# EAGLE board LED_sculpture (EAGLE 9.4.2)
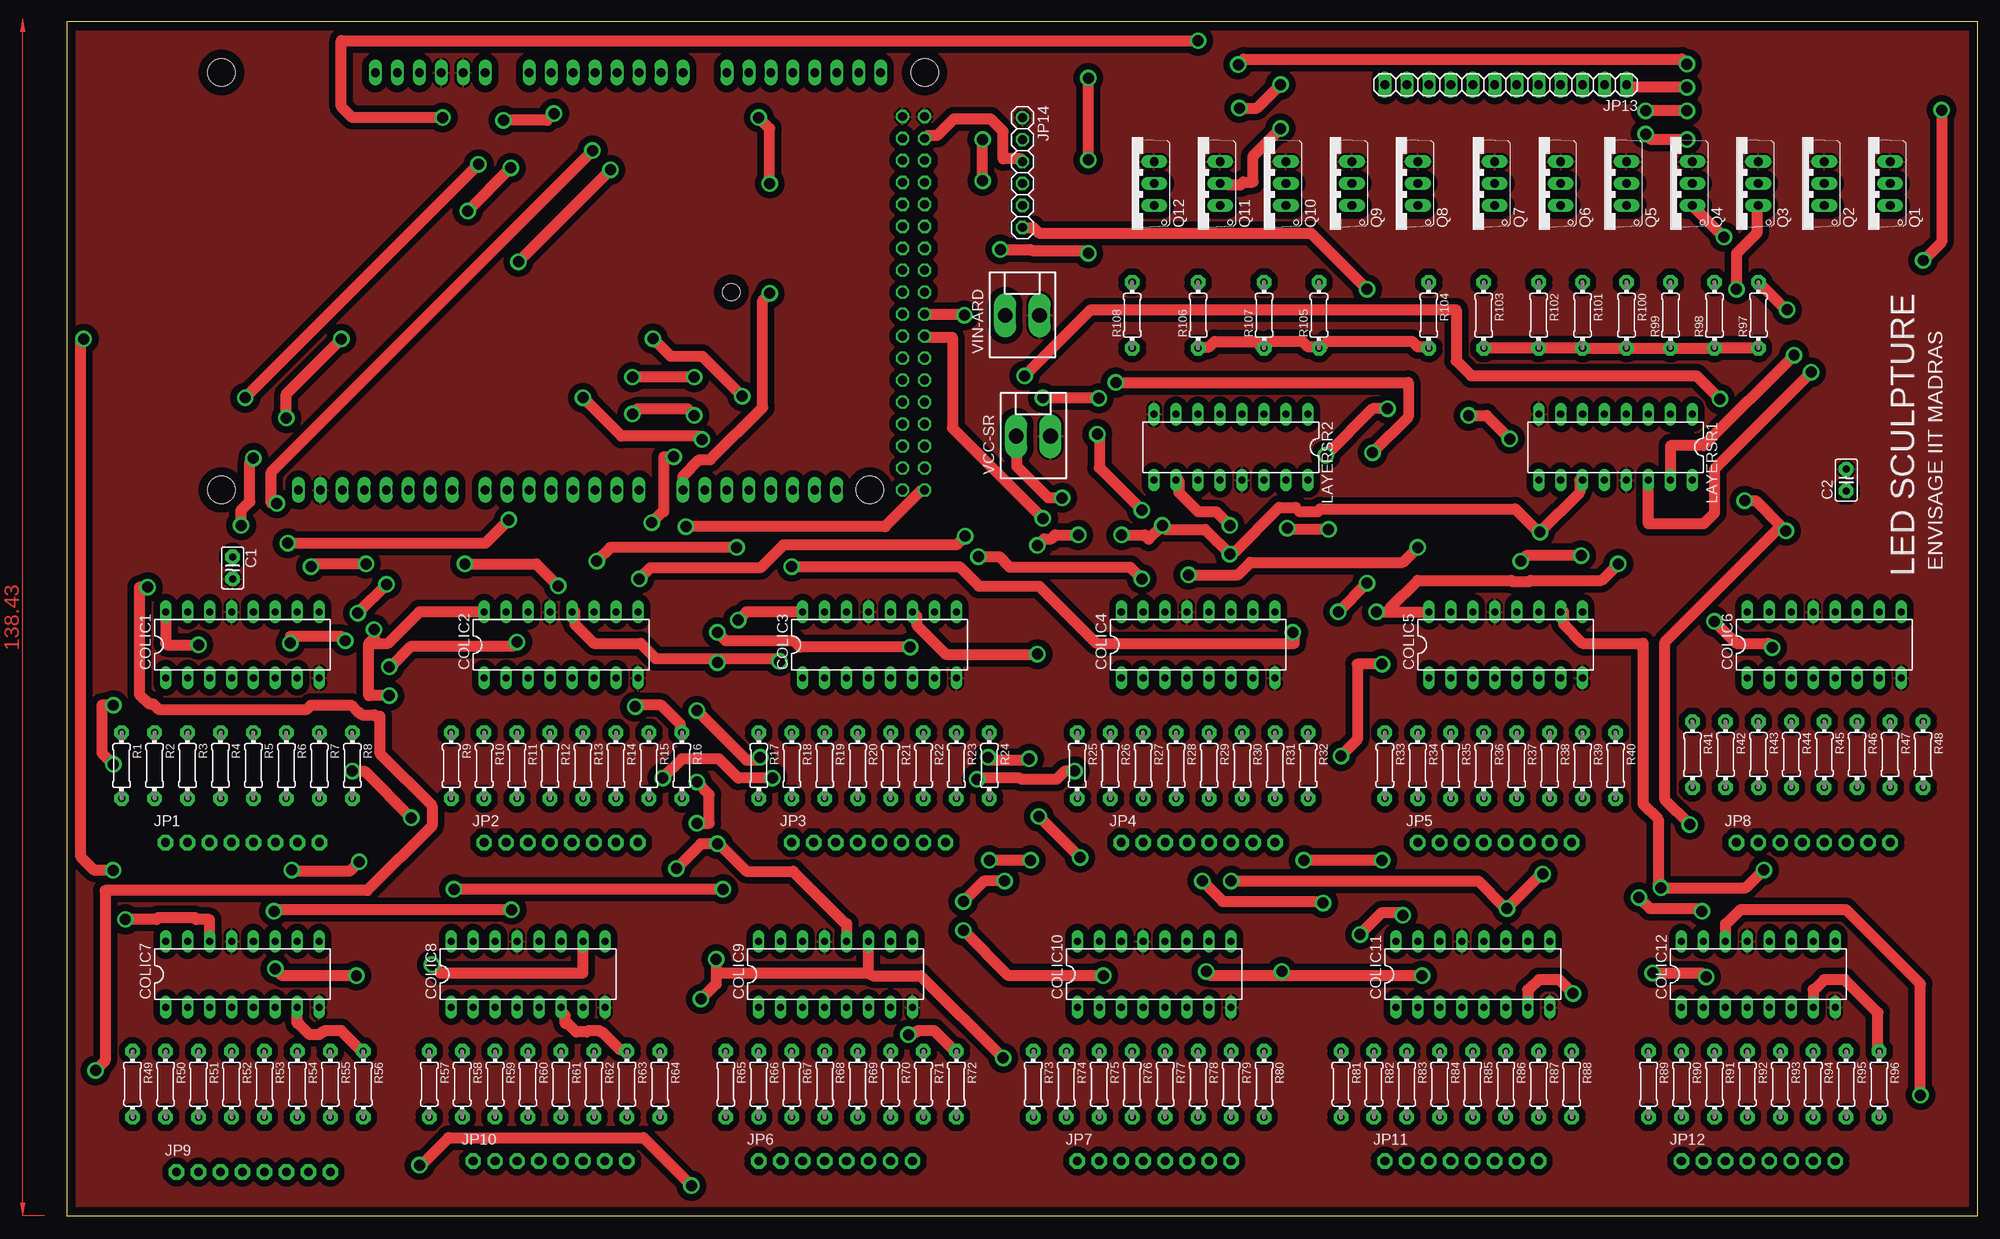
[diagram p3: board, top side]
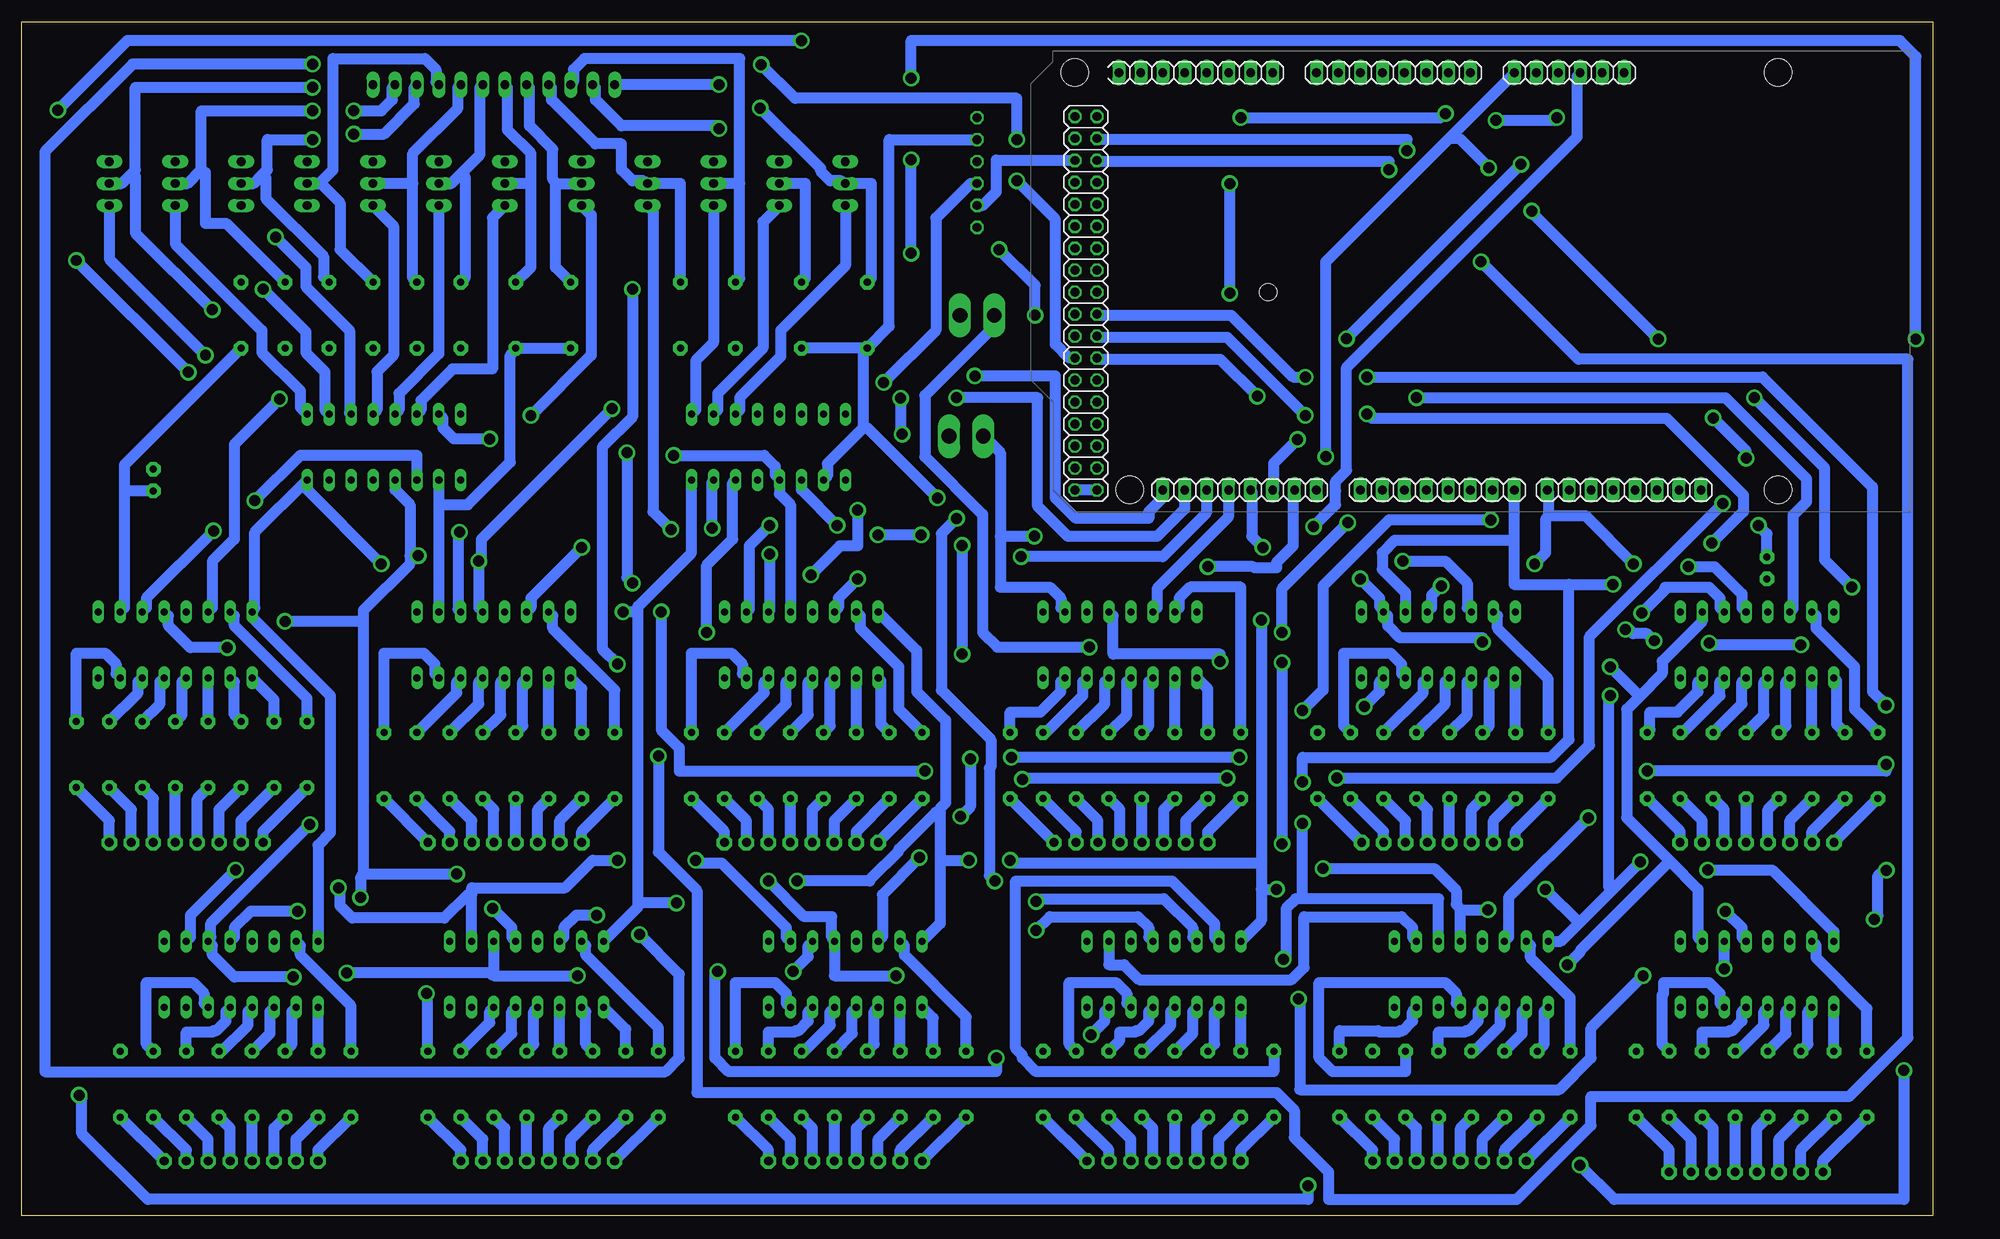
[diagram p4: board, bottom side, seen from below]

Size 220.96 x 138.1 mm. Coordinates in mm from the lower left corner, seen from the top.
Outline: 0,0 220.96,0 220.96,138.1 0,138.1 0,0
Copper layers (1*16): Top 0.035mm / dielectric 1.5mm / Bottom 0.035mm
Design rules "default": minimum track width 6mil, minimum drill 0.35mm, track to track 6mil, track to pad 6mil, pad to pad 6mil, via to via 6mil, smd to smd 6mil, copper to edge 40mil, drill to drill 6mil, minimum pad ring 10mil, minimum via ring 8mil, stop-mask expansion 4mil, vias tented up to drill 0mil, thermal gap 10mil
Net classes: 0 default: width 1.27 mm, drill 1.27 mm, clearance 0.762 mm

## Footprints (pad centres in the part's own frame; a part is rotated, then mirrored left to right if it is on the bottom)
C025-025X050 = drill 0.813 pad 1.676 octagon: 1 -1.27,0; 2 1.27,0
DIL16 = drill 0.813 long: 1 -8.89,-3.81; 2 -6.35,-3.81; 3 -3.81,-3.81; 4 -1.27,-3.81; 5 1.27,-3.81; 6 3.81,-3.81; 7 6.35,-3.81; 8 8.89,-3.81; 9 8.89,3.81; 10 6.35,3.81; 11 3.81,3.81; 12 1.27,3.81; 13 -1.27,3.81; 14 -3.81,3.81; 15 -6.35,3.81; 16 -8.89,3.81
MEGA_ARDUINO = drill 1.016 long: 1 33.02,2.54; 2 35.56,2.54; 3 38.1,2.54; 4 40.64,2.54; 5 43.18,2.54; 6 45.72,2.54; 7 50.8,2.54; 8 53.34,2.54; 9 55.88,2.54; 10 58.42,2.54; 11 60.96,2.54; 12 63.5,2.54; 13 66.04,2.54; 14 68.58,2.54; 15 73.66,2.54; 16 76.2,2.54; 17 78.74,2.54; 18 81.28,2.54; 19 83.82,2.54; 20 86.36,2.54; 21 88.9,2.54; 22 91.44,2.54; 23 86.36,50.8; 24 83.82,50.8; 25 81.28,50.8; 26 78.74,50.8; 27 76.2,50.8; 28 73.66,50.8; 29 71.12,50.8; 30 68.58,50.8; 31 63.5,50.8; 32 60.96,50.8; 33 58.42,50.8; 34 55.88,50.8; 35 53.34,50.8; 36 50.8,50.8; 37 48.26,50.8; 38 45.72,50.8; 39 41.91,50.8; 40 39.37,50.8; 41 36.83,50.8; 42 34.29,50.8; 43 31.75,50.8; 44 29.21,50.8; 45 26.67,50.8; 46 24.13,50.8 | drill 1.016 octagon: 47 93.98,50.8; 48 96.52,50.8; 49 93.98,48.26; 50 96.52,48.26; 51 93.98,45.72; 52 96.52,45.72; 53 93.98,43.18; 54 96.52,43.18; 55 93.98,40.64; 56 96.52,40.64; 57 93.98,38.1; 58 96.52,38.1; 59 93.98,35.56; 60 96.52,35.56; 61 93.98,33.02; 62 96.52,33.02; 63 93.98,30.48; 64 96.52,30.48; 65 93.98,27.94; 66 96.52,27.94; 67 93.98,25.4; 68 96.52,25.4; 69 93.98,22.86; 70 96.52,22.86; 71 93.98,20.32; 72 96.52,20.32; 73 93.98,17.78; 74 96.52,17.78; 75 93.98,15.24; 76 96.52,15.24; 77 93.98,12.7; 78 96.52,12.7; 79 93.98,10.16; 80 96.52,10.16; 81 93.98,7.62; 82 96.52,7.62 | hole 3.2: 15.24,50.8; 15.24,2.54; 90.17,50.8; 96.52,2.54 | hole 2: 74.168,27.94
1X08-CLEANBIG = drill 1.016 pad 1.778 octagon: 1 -8.89,0; 2 -6.35,0; 3 -3.81,0; 4 -1.27,0; 5 1.27,0; 6 3.81,0; 7 6.35,0; 8 8.89,0
1X12 = drill 1.016 long: 1 -13.97,0; 2 -11.43,0; 3 -8.89,0; 4 -6.35,0; 5 -3.81,0; 6 -1.27,0; 7 1.27,0; 8 3.81,0; 9 6.35,0; 10 8.89,0; 11 11.43,0; 12 13.97,0
1X06 = drill 1.016 octagon: 1 -6.35,0; 2 -3.81,0; 3 -1.27,0; 4 1.27,0; 5 3.81,0; 6 6.35,0
TO220V = drill 1.016 long: 1 -2.54,-2.54; 2 0,-2.54; 3 2.54,-2.54
0204/7 = drill 0.813 pad 1.676 octagon: 1 -3.81,0; 2 3.81,0
KK-156-2 = drill 1.7 pad 2.184 long: 1 -1.98,0; 2 1.98,0

## Placement (x,y rotation side)
C1  [C025-025X050]  19.18,74.93 270 top
C2  [C025-025X050]  205.74,85.09 90 top
COLIC1  74HC595N  [DIL16]  20.32,66.04 0 top
COLIC2  74HC595N  [DIL16]  57.15,66.04 0 top
COLIC3  74HC595N  [DIL16]  93.98,66.04 0 top
COLIC4  74HC595N  [DIL16]  130.81,66.04 0 top
COLIC5  74HC595N  [DIL16]  166.37,66.04 0 top
COLIC6  74HC595N  [DIL16]  203.2,66.04 0 top
COLIC7  74HC595N  [DIL16]  20.32,27.94 0 top
COLIC8  74HC595N  [DIL16]  53.34,27.94 0 top
COLIC9  74HC595N  [DIL16]  88.9,27.94 0 top
COLIC10  74HC595N  [DIL16]  125.73,27.94 0 top
COLIC11  74HC595N  [DIL16]  162.56,27.94 0 top
COLIC12  74HC595N  [DIL16]  195.58,27.94 0 top
IC1  [MEGA_ARDUINO]  2.67,134.75 180 bottom
JP1  [1X08-CLEANBIG]  20.32,43.18 0 top
JP2  [1X08-CLEANBIG]  57.15,43.18 0 top
JP3  [1X08-CLEANBIG]  92.71,43.18 0 top
JP4  [1X08-CLEANBIG]  130.81,43.18 0 top
JP5  [1X08-CLEANBIG]  165.1,43.18 0 top
JP6  [1X08-CLEANBIG]  88.9,6.35 0 top
JP7  [1X08-CLEANBIG]  125.73,6.35 0 top
JP8  [1X08-CLEANBIG]  201.93,43.18 0 top
JP9  [1X08-CLEANBIG]  21.59,5.08 0 top
JP10  [1X08-CLEANBIG]  55.88,6.35 0 top
JP11  [1X08-CLEANBIG]  161.29,6.35 0 top
JP12  [1X08-CLEANBIG]  195.58,6.35 0 top
JP13  [1X12]  166.37,130.81 180 top
JP14  [1X06]  110.49,120.65 270 top
LAYERSR1  74HC595N  [DIL16]  179.07,88.9 180 top
LAYERSR2  74HC595N  [DIL16]  134.62,88.9 180 top
Q1  [TO220V]  208.28,119.38 90 top
Q2  [TO220V]  200.66,119.38 90 top
Q3  [TO220V]  193.04,119.38 90 top
Q4  [TO220V]  185.42,119.38 90 top
Q5  [TO220V]  177.8,119.38 90 top
Q6  [TO220V]  170.18,119.38 90 top
Q7  [TO220V]  162.56,119.38 90 top
Q8  [TO220V]  153.67,119.38 90 top
Q9  [TO220V]  146.05,119.38 90 top
Q10  [TO220V]  138.43,119.38 90 top
Q11  [TO220V]  130.81,119.38 90 top
Q12  [TO220V]  123.19,119.38 90 top
R1  [0204/7]  6.35,52.07 270 top
R2  [0204/7]  10.16,52.07 270 top
R3  [0204/7]  13.97,52.07 270 top
R4  [0204/7]  17.78,52.07 270 top
R5  [0204/7]  21.59,52.07 270 top
R6  [0204/7]  25.4,52.07 270 top
R7  [0204/7]  29.21,52.07 270 top
R8  [0204/7]  33.02,52.07 270 top
R9  [0204/7]  44.45,52.07 270 top
R10  [0204/7]  48.26,52.07 270 top
R11  [0204/7]  52.07,52.07 270 top
R12  [0204/7]  55.88,52.07 270 top
R13  [0204/7]  59.69,52.07 270 top
R14  [0204/7]  63.5,52.07 270 top
R15  [0204/7]  67.31,52.07 270 top
R16  [0204/7]  71.12,52.07 270 top
R17  [0204/7]  80.01,52.07 270 top
R18  [0204/7]  83.82,52.07 270 top
R19  [0204/7]  87.63,52.07 270 top
R20  [0204/7]  91.44,52.07 270 top
R21  [0204/7]  95.25,52.07 270 top
R22  [0204/7]  99.06,52.07 270 top
R23  [0204/7]  102.87,52.07 270 top
R24  [0204/7]  106.68,52.07 270 top
R25  [0204/7]  116.84,52.07 270 top
R26  [0204/7]  120.65,52.07 270 top
R27  [0204/7]  124.46,52.07 270 top
R28  [0204/7]  128.27,52.07 270 top
R29  [0204/7]  132.08,52.07 270 top
R30  [0204/7]  135.89,52.07 270 top
R31  [0204/7]  139.7,52.07 270 top
R32  [0204/7]  143.51,52.07 270 top
R33  [0204/7]  152.4,52.07 270 top
R34  [0204/7]  156.21,52.07 270 top
R35  [0204/7]  160.02,52.07 270 top
R36  [0204/7]  163.83,52.07 270 top
R37  [0204/7]  167.64,52.07 270 top
R38  [0204/7]  171.45,52.07 270 top
R39  [0204/7]  175.26,52.07 270 top
R40  [0204/7]  179.07,52.07 270 top
R41  [0204/7]  187.96,53.34 270 top
R42  [0204/7]  191.77,53.34 270 top
R43  [0204/7]  195.58,53.34 270 top
R44  [0204/7]  199.39,53.34 270 top
R45  [0204/7]  203.2,53.34 270 top
R46  [0204/7]  207.01,53.34 270 top
R47  [0204/7]  210.82,53.34 270 top
R48  [0204/7]  214.63,53.34 270 top
R49  [0204/7]  7.62,15.24 270 top
R50  [0204/7]  11.43,15.24 270 top
R51  [0204/7]  15.24,15.24 270 top
R52  [0204/7]  19.05,15.24 270 top
R53  [0204/7]  22.86,15.24 270 top
R54  [0204/7]  26.67,15.24 270 top
R55  [0204/7]  30.48,15.24 270 top
R56  [0204/7]  34.29,15.24 270 top
R57  [0204/7]  41.91,15.24 270 top
R58  [0204/7]  45.72,15.24 270 top
R59  [0204/7]  49.53,15.24 270 top
R60  [0204/7]  53.34,15.24 270 top
R61  [0204/7]  57.15,15.24 270 top
R62  [0204/7]  60.96,15.24 270 top
R63  [0204/7]  64.77,15.24 270 top
R64  [0204/7]  68.58,15.24 270 top
R65  [0204/7]  76.2,15.24 270 top
R66  [0204/7]  80.01,15.24 270 top
R67  [0204/7]  83.82,15.24 270 top
R68  [0204/7]  87.63,15.24 270 top
R69  [0204/7]  91.44,15.24 270 top
R70  [0204/7]  95.25,15.24 270 top
R71  [0204/7]  99.06,15.24 270 top
R72  [0204/7]  102.87,15.24 270 top
R73  [0204/7]  111.76,15.24 270 top
R74  [0204/7]  115.57,15.24 270 top
R75  [0204/7]  119.38,15.24 270 top
R76  [0204/7]  123.19,15.24 270 top
R77  [0204/7]  127,15.24 270 top
R78  [0204/7]  130.81,15.24 270 top
R79  [0204/7]  134.62,15.24 270 top
R80  [0204/7]  138.43,15.24 270 top
R81  [0204/7]  147.32,15.24 270 top
R82  [0204/7]  151.13,15.24 270 top
R83  [0204/7]  154.94,15.24 270 top
R84  [0204/7]  158.75,15.24 270 top
R85  [0204/7]  162.56,15.24 270 top
R86  [0204/7]  166.37,15.24 270 top
R87  [0204/7]  170.18,15.24 270 top
R88  [0204/7]  173.99,15.24 270 top
R89  [0204/7]  182.88,15.24 270 top
R90  [0204/7]  186.69,15.24 270 top
R91  [0204/7]  190.5,15.24 270 top
R92  [0204/7]  194.31,15.24 270 top
R93  [0204/7]  198.12,15.24 270 top
R94  [0204/7]  201.93,15.24 270 top
R95  [0204/7]  205.74,15.24 270 top
R96  [0204/7]  209.55,15.24 270 top
R97  [0204/7]  195.58,104.14 90 top
R98  [0204/7]  190.5,104.14 90 top
R99  [0204/7]  185.42,104.14 90 top
R100  [0204/7]  180.34,104.14 90 top
R101  [0204/7]  175.26,104.14 270 top
R102  [0204/7]  170.18,104.14 270 top
R103  [0204/7]  163.83,104.14 270 top
R104  [0204/7]  157.48,104.14 270 top
R105  [0204/7]  144.78,104.14 90 top
R106  [0204/7]  130.81,104.14 90 top
R107  [0204/7]  138.43,104.14 90 top
R108  [0204/7]  123.19,104.14 90 top
VCC-SR  [KK-156-2]  111.76,90.17 0 top
VIN-ARD  [KK-156-2]  110.49,104.14 0 top

## Tracks (layer width: path | path; a pad name or v marks a point on that pad's centre or on a via)
5V  (via drill 1.27)
  Top 1.27: v52.07,66.36 51.59,65.88 39.85,65.88 37.47,63.5 v37.31,63.5 | COLIC8.10 59.69,28.1 43.18,28.1 v42.23,29.05 | v134.46,79.85 132.87,81.44 130.81,81.44 128.59,83.66 128.59,85.09 LAYERSR2.10 | R106.1 130.97,100.33 131.13,100.49 132.08,100.49 132.72,101.12 137.48,101.12 137.95,100.65 R107.1 139.22,101.12 142.88,101.12 143.51,100.49 144.46,100.49 144.62,100.33 R105.1 145.26,100.65 145.73,101.12 155.58,101.12 156.21,100.49 157.16,100.49 157.32,100.33 R104.2 | v115.09,83.03 113.51,83.03 109.85,86.68 109.85,90.17 VCC-SR.1 | v152.08,41.12 v143.03,41.12 | v196.22,40 194.15,37.94 v184.31,37.94 183.99,38.42 183.99,45.88 182.25,47.62 182.25,66.2 175.26,66.2 173.04,68.42 173.04,69.85 COLIC5.10 | R97.1 R98.1 R99.1 R100.1 R101.2 R102.2 R103.2 | v66.2,73.66 67.47,74.93 80.2,74.93 82.87,77.6 102.87,77.6 v103.89,78.61
  Bottom 1.27: COLIC8.10 60.17,32.23 60.17,33.34 61.44,34.61 72.71,34.61 72.71,28.73 74.14,27.3 91.76,27.3 93.5,29.05 95.25,29.05 COLIC9.10 | COLIC7.10 27.15,32.23 27.15,37.78 30.4,41.04 | 30.4,41.04 35.4,46.04 35.4,58.58 33.89,60.09 | 33.89,60.09 31.27,62.71 31.27,64.13 26.67,68.74 COLIC1.10 | v52.07,66.36 52.07,66.83 61.6,66.83 63.02,68.26 63.02,69.37 COLIC2.10 63.82,70.33 63.98,70.48 63.98,71.44 v66.2,73.66 | 33.89,60.09 v37.31,63.5 | v42.23,29.05 40.8,30.48 40.8,30.64 30.4,41.04 | COLIC3.10 100.81,70.33 100.81,71.44 102.08,72.71 107.79,72.71 107.79,78.61 | 107.79,78.61 107.79,88.27 109.7,90.17 VCC-SR.1 | COLIC4.10 136.84,70.17 136.84,77.47 v134.46,79.85 | JP14.2 120.65,124.46 120.65,102.87 R108.1 | R108.1 R106.1 | LAYERSR2.10 127.79,85.57 127.79,87 123.67,91.12 | 123.67,91.12 123.67,99.85 R108.1 | v115.09,83.03 123.19,91.12 123.67,91.12 | COLIC10.10 132.56,32.23 132.56,33.34 140.02,40.8 143.03,40.8 v143.03,41.12 | v152.08,41.12 154.94,41.12 158.12,37.94 168.91,37.94 168.91,37.15 | COLIC11.10 168.91,37.15 | COLIC12.10 201.45,32.23 201.45,34.77 v196.22,40 | v184.31,37.94 184.15,37.78 184.15,35.88 182.72,34.45 172.09,34.45 169.39,37.15 168.91,37.15 | R104.2 R103.2 164.15,99.85 164.47,99.54 164.47,87.15 169.39,82.23 172.72,82.23 | LAYERSR1.10 172.72,82.23 | 172.72,82.23 COLIC5.10 | COLIC6.10 209.07,70.33 209.07,83.82 | 209.07,83.82 209.07,86.84 R97.1 | 107.79,78.61 v103.89,78.61 | C2.1 209.07,83.82
+5V  (via drill 1.27)
  Top 1.27: v71.6,79.69 94.61,79.69 98.74,83.82 99.06,83.82 IC1.48
  Bottom 1.27: IC1.47 96.68,83.98 99.06,83.98 IC1.48 | v71.6,79.69 69.06,82.23 69.06,83.82 69.06,84.93 67.79,86.2 67.79,98.11 41.12,124.78 41.12,131.76 40.8,132.08 IC1.3
GND
  pour Top: 0,138.43 0,0 220.98,0 220.98,138.43
N$1  (via drill 1.27)
  Top 1.27: v166.85,89.85 164.15,92.55 v162.08,92.55
  Bottom 1.27: LAYERSR1.7 172.24,92.23 172.24,91.12 170.97,89.85 v166.85,89.85 | v162.08,92.55 155.1,99.54 155.1,115.73 Q8.1
N$2
  Bottom 1.27: LAYERSR1.6 174.78,93.19 174.78,94.3 171.13,97.95 166.53,97.95 166.53,115.41 Q7.1
N$3
  Bottom 1.27: LAYERSR1.5 177.32,93.19 177.32,95.09 172.72,99.69 Q6.1
N$4
  Bottom 1.27: LAYERSR1.4 179.86,93.19 179.86,97.63 177.96,99.54 177.96,114.46 Q5.1
N$5  (via drill 1.27)
  Top 1.27: Q4.1 v191.61,113.19
  Bottom 1.27: LAYERSR1.3 183.04,92.87 183.04,102.39 188.12,107.47 188.12,109.7 v191.61,113.19
N$6  (via drill 1.27)
  Top 1.27: v193.04,107.16 193.04,111.28 195.42,113.66 195.42,116.84 Q3.1
  Bottom 1.27: LAYERSR1.2 185.9,93.19 185.9,97.63 188.12,99.85 188.12,102.23 v193.04,107.16
N$7  (via drill 1.27)
  Top 1.27: JP13.1 180.66,130.49 v187.33,130.49 | R97.2 198.76,104.77 v198.91,104.77
  Bottom 1.27: v187.33,130.49 207.8,130.49 207.8,120.97 208.2,120.57 | 208.2,120.57 209.39,119.38 Q1.2 | v198.91,104.77 207.8,113.66 207.8,120.17 208.2,120.57
N$8  (via drill 1.27)
  Top 1.27: LAYERSR1.15 185.42,89.06 189.23,89.06 v199.71,99.54
  Bottom 1.27: v199.71,99.54 210.82,110.65 Q1.1
N$9
  Bottom 1.27: LAYERSR2.3 137.95,93.19 137.95,94.61 133.19,99.38 133.19,102.39 125.73,109.86 Q12.1
N$10
  Bottom 1.27: 175.74,119.38 Q5.2 | 175.74,119.38 175.74,108.43 R101.1 | JP13.5 170.5,130.49 170.5,128.11 175.74,122.87 175.74,119.38
N$11  (via drill 1.27)
  Top 1.27: v182.56,125.09 183.2,124.46 v187.33,124.46
  Bottom 1.27: JP13.3 175.58,130.49 175.58,128.59 179.07,125.09 v182.56,125.09 | v187.33,124.46 192.56,124.46 192.56,120.97 193.12,120.41 | 193.12,120.41 194.15,119.38 Q3.2 | R99.2 186.06,108.58 186.06,110.97 192.72,117.63 192.72,120.02 193.12,120.41
N$12
  Bottom 1.27: JP13.6 167.96,130.49 167.96,122.71 170.1,120.57 | 170.1,120.57 171.29,119.38 Q6.2 | R102.1 169.7,108.43 169.7,120.17 170.1,120.57
N$13
  Bottom 1.27: JP14.5 109.85,116.84 108.27,118.43 108.27,122.08 99.22,122.08 IC1.78
N$14  (via drill 1.27)
  Top 1.27: v187.33,127.79 v182.56,127.79
  Bottom 1.27: JP13.2 178.12,130.49 178.12,129.06 179.39,127.79 v182.56,127.79 | v187.33,127.79 200.18,127.79 200.18,120.97 | 200.18,120.97 201.77,119.38 Q2.2 | R98.2 197.33,114.78 199.71,114.78 199.71,120.65 200.18,120.97
N$15  (via drill 1.27)
  Top 1.27: v52.23,110.33 v62.87,120.97 | v147.32,53.18 149.23,55.09 149.23,63.82 v152.08,63.82 | v150.34,107.16 143.83,113.66 112.39,113.66 111.76,114.3 JP14.6
  Bottom 1.27: v62.87,120.97 62.87,121.92 96.52,121.92 IC1.77 | v52.23,110.33 40.96,99.06 2.89,99.06 2.89,20.61 9.68,13.81 39.53,13.81 39.53,10.48 48.1,1.91 69.85,1.91 69.85,5.08 73.82,9.05 73.82,12.22 75.88,14.29 142.88,14.29 142.88,37.62 147.32,42.07 v147.32,53.18 | v152.08,63.82 153.83,65.56 153.83,88.9 150.34,92.39 v150.34,107.16
N$16
  Bottom 1.27: JP13.4 173.04,131.13 173.04,132.56 174.31,133.83 184.94,133.83 184.94,120.97 186.45,119.46 | 186.45,119.46 186.53,119.38 Q4.2 | R100.2 184.15,111.76 184.15,117.16 186.45,119.46
N$17  (via drill 1.27)
  Top 1.27: v60.8,123.19 23.65,86.04 23.65,82.39 v24.29,82.39 | v68.9,50.64 71.12,52.86 75.41,52.86 77.63,50.64 v81.6,50.64 | v105.25,50.48 105.41,50.64 110.17,50.64 110.33,50.48 114.46,50.48 115.41,51.44 v116.52,51.44 | v150.34,73.18 v147,69.85 | v150.97,88.27 155.1,92.39 155.1,96.36 v121.28,96.36
  Bottom 1.27: v60.8,123.19 60.8,124.46 96.52,124.46 IC1.79 | v24.29,82.39 39.69,66.99 39.69,54.45 43.5,50.64 v68.9,50.64 | v81.6,50.64 105.25,50.64 v105.25,50.48 | v116.52,51.44 144.94,51.44 144.94,54.13 147,56.2 v147,69.85 | v150.34,73.18 150.97,73.82 v150.97,88.27 | v121.28,96.36 115.25,102.39 115.25,115.38 111.25,119.38 JP14.4
N$18
  Bottom 1.27: LAYERSR2.2 140.49,93.19 140.49,95.09 135.26,100.33 135.26,114.94 Q11.1
N$19
  Top 1.27: IC1.80 99.54,124.94 100.65,124.94 102.55,126.84 106.84,126.84 108.27,125.41 108.27,122.24 110.33,122.24 110.49,122.08 JP14.3
N$20  (via drill 1.27)
  Top 1.27: v141.13,79.53 141.29,79.38 v145.89,79.38
  Bottom 1.27: LAYERSR2.15 141.13,84.93 v141.13,79.53 | v145.89,79.38 147.96,81.44 147.96,116.2 Q9.1
N$21  (via drill 1.27)
  Top 1.27: IC1.64 103.66,104.27 v103.79,104.14 | v107.95,111.76 111.43,111.76 111.55,111.63 118.11,111.63 v118.11,111.32 | v118.11,122.11 v118.11,131.57 | COLIC7.14 16.51,34.29 15,34.29 14.82,34.47 10.58,34.47 10.4,34.29 v6.79,34.29 | v5.37,39.97 3.21,39.97 1.65,41.53 1.65,101.09 v1.97,101.41
  Bottom 1.27: v103.79,104.14 103.79,107.6 v107.95,111.76 | v118.11,111.32 v118.11,122.11 | v118.11,131.57 118.11,135.89 3.81,135.89 1.97,134.05 v1.97,101.41 | v6.79,34.29 6.35,34.73 6.35,39.37 5.75,39.97 v5.37,39.97
N$22
  Bottom 1.27: 162.08,119.38 Q7.2 | 162.08,119.38 162.08,109.7 R103.1 | JP13.7 164.78,130.49 164.78,125.57 162.08,122.87 162.08,119.38
N$23  (via drill 1.27)
  Top 1.27: v103.66,36.35 106.05,38.73 v108.43,38.73 | v112.87,80.64 102.39,91.12 102.39,101.6 99.22,101.6 IC1.62
  Bottom 1.27: COLIC9.14 85.57,32.23 85.57,33.34 88.9,36.67 103.66,36.67 v103.66,36.35 | v108.43,38.73 109.06,39.37 109.06,51.75 108.9,51.91 108.9,55.09 114.62,60.8 114.62,78.9 v112.87,80.64
N$24
  Bottom 1.27: 159.23,119.38 Q8.2 | 159.23,119.38 159.23,109.7 R104.1 | JP13.8 162.24,130.49 162.24,126.05 159.54,123.35 159.54,119.86 159.23,119.38
N$25
  Bottom 1.27: R105.2 144.78,119.38 Q9.2 149.07,119.7 150.34,119.7 151.61,120.97 151.61,123.98 154.62,123.98 159.7,129.06 159.7,130.49 JP13.9
N$26
  Bottom 1.27: 137.95,119.38 Q10.2 | 137.95,119.38 137.95,108.43 R107.2 | JP13.10 157.16,131.13 157.16,132.56 155.89,133.83 137.95,133.83 137.95,119.38
N$27  (via drill 1.27)
  Top 1.27: v140.34,125.73 137.16,122.55 137.16,119.54 136.05,119.54 135.73,119.22 134.3,119.22 134.14,119.38 Q11.2
  Bottom 1.27: Q11.2 130.33,119.38 130.33,108.43 R106.2 | JP13.11 154.62,130.49 154.62,129.06 151.61,126.05 140.34,126.05 v140.34,125.73
N$28  (via drill 1.27)
  Top 1.27: v140.34,130.81 137.64,128.11 v135.57,128.11
  Bottom 1.27: R108.2 122.71,108.43 122.71,119.38 Q12.2 126.21,119.7 127.48,119.7 128.59,120.81 128.59,121.13 v135.57,128.11 | v140.34,130.81 JP13.12
N$29  (via drill 1.27)
  Top 1.27: v39.85,46.04 34.45,51.44 v33.02,51.44 | v5.4,52.23 4.06,53.56 4.06,59.05 v5.4,59.05 | v72.55,97 v65.41,97
  Bottom 1.27: COLIC8.14 49.05,32.23 49.05,36.83 v39.85,46.04 | v33.02,51.44 5.4,51.44 v5.4,52.23 | v5.4,59.05 6.98,60.64 6.98,84.3 19.68,97 v65.41,97 | v72.55,97 73.98,97 81.12,104.14 96.52,104.14 IC1.63
N$32  (via drill 1.27)
  Top 1.27: IC1.30 71.25,85.55 73.14,87.44 74.41,87.44 80.45,93.48 80.45,105.86 v81.28,106.68 | v81.28,119.38 81.28,125.73 v80.01,127 | v56.35,127.47 55.57,126.69 v50.49,126.69 | v43.47,127 33.02,127 31.75,128.27 31.75,135.89 v130.81,135.89 | v216.77,127.87 216.77,112.63 v214.63,110.49 | v201.69,97.55 190.5,86.36 190.5,81.28 189.23,80.01 182.88,80.01 LAYERSR1.14
  Bottom 1.27: v81.28,106.68 v81.28,119.38 | v80.01,127 56.82,127 v56.35,127.47 | v50.49,126.69 43.78,126.69 v43.47,127 | v130.81,135.89 159.24,135.89 208.75,135.89 v216.77,127.87 | v214.63,110.49 v201.69,97.55
N$33
  Bottom 1.27: COLIC2.15 50.32,69.37 50.32,67.94 44.45,62.07 R9.1
N$34
  Bottom 1.27: COLIC1.15 13.49,69.37 13.49,67.94 9.05,63.5 9.05,58.58 R1.1
N$35
  Bottom 1.27: COLIC1.1 11.11,61.91 11.11,56.83 R2.1
N$36
  Bottom 1.27: R3.1 COLIC1.2
N$37
  Bottom 1.27: COLIC1.3 16.99,61.75 16.99,56.67 R4.1
N$38
  Bottom 1.27: COLIC1.4 19.53,61.75 19.53,57.94 R5.1
N$39
  Bottom 1.27: COLIC1.5 22.07,61.75 22.07,59.21 R6.1
N$40
  Bottom 1.27: COLIC1.6 24.61,61.75 24.61,60.17 28.89,55.88 R7.1
N$41
  Bottom 1.27: COLIC1.7 27.15,61.75 27.15,60.64 29.53,58.26 32.7,58.26 32.7,56.2 R8.1
N$42
  Bottom 1.27: R10.1 COLIC2.1
N$43
  Bottom 1.27: COLIC2.2 51.28,61.75 51.28,56.67 R11.1
N$44
  Bottom 1.27: COLIC2.3 53.82,61.75 53.82,57.94 R12.1
N$45
  Bottom 1.27: COLIC2.4 56.36,61.75 56.36,59.21 R13.1
N$46
  Bottom 1.27: COLIC2.5 58.9,61.75 58.9,60.48 R14.1
N$47
  Bottom 1.27: COLIC2.6 61.44,62.71 61.44,63.82 62.71,65.09 68.1,65.09 68.1,56.67 R15.1
N$48  (via drill 1.27)
  Top 1.27: v65.72,58.9 65.88,59.05 68.74,59.05 70.96,56.83 70.96,55.88 R16.1
  Bottom 1.27: COLIC2.7 63.98,61.75 63.98,60.64 v65.72,58.9
N$49
  Bottom 1.27: COLIC3.15 87.15,70.33 87.15,71.44 85.88,72.71 80.01,72.71 R17.1
N$50
  Bottom 1.27: COLIC3.1 83.82,60.96 R18.1
N$51
  Bottom 1.27: R19.1 COLIC3.2
N$52
  Bottom 1.27: COLIC3.3 90.65,61.75 90.65,56.67 R20.1
N$53
  Bottom 1.27: COLIC3.4 93.19,61.75 93.19,57.94 R21.1
N$54
  Bottom 1.27: COLIC3.5 95.73,61.75 95.73,59.21 R22.1
N$55
  Bottom 1.27: COLIC3.6 98.27,61.75 98.27,60.17 102.55,55.88 R23.1
N$56
  Bottom 1.27: COLIC3.7 100.81,61.75 100.81,60.64 103.19,58.26 106.68,58.26 R24.1
N$57
  Bottom 1.27: COLIC4.15 123.98,69.37 123.98,67.94 119.54,63.5 119.54,58.58 R25.1
N$58
  Bottom 1.27: COLIC4.1 121.6,61.91 121.6,56.83 R26.1
N$59
  Bottom 1.27: R27.1 COLIC4.2
N$60
  Bottom 1.27: COLIC4.3 127.48,61.75 127.48,56.67 R28.1
N$61
  Bottom 1.27: COLIC4.4 130.02,61.75 130.02,57.94 R29.1
N$62
  Bottom 1.27: COLIC4.5 132.56,61.75 132.56,59.21 R30.1
N$63
  Bottom 1.27: COLIC4.6 135.1,61.75 135.1,60.48 R31.1
N$64
  Bottom 1.27: COLIC4.7 137.64,62.71 137.64,63.82 138.91,65.09 143.51,65.09 R32.1
N$65
  Bottom 1.27: COLIC5.15 159.54,69.37 159.54,67.94 152.4,60.8 R33.1
N$66
  Bottom 1.27: COLIC5.1 156.21,60.96 R34.1
N$67
  Bottom 1.27: R35.1 COLIC5.2
N$68
  Bottom 1.27: COLIC5.3 163.04,61.75 163.04,56.67 R36.1
N$69
  Bottom 1.27: COLIC5.4 165.58,61.75 165.58,57.94 R37.1
N$70
  Bottom 1.27: COLIC5.5 168.12,61.75 168.12,59.21 R38.1
N$71
  Bottom 1.27: COLIC5.6 170.66,61.75 170.66,60.48 R39.1
N$72
  Bottom 1.27: COLIC5.7 173.2,62.71 173.2,63.82 174.47,65.09 179.07,65.09 R40.1
N$73
  Bottom 1.27: COLIC6.15 196.37,69.37 196.37,68.26 187.96,59.85 R41.1
N$74
  Bottom 1.27: COLIC6.1 191.77,59.69 R42.1
N$75
  Bottom 1.27: COLIC6.2 196.37,61.75 196.37,57.94 R43.1
N$76
  Bottom 1.27: R44.1 COLIC6.3
N$77
  Bottom 1.27: COLIC6.4 202.41,61.75 202.41,57.94 R45.1
N$78
  Bottom 1.27: COLIC6.5 204.95,61.75 204.95,59.21 R46.1
N$79
  Bottom 1.27: COLIC6.6 207.49,61.75 207.49,60.48 R47.1
N$80
  Bottom 1.27: COLIC6.7 210.03,62.71 210.03,63.82 211.3,65.09 214.63,65.09 R48.1
N$81
  Bottom 1.27: COLIC7.15 13.49,31.27 13.49,29.84 7.62,23.97 R49.1
N$82
  Bottom 1.27: R50.1 COLIC7.1
N$83
  Bottom 1.27: COLIC7.2 14.45,23.65 14.45,19.84 R51.1
N$84
  Bottom 1.27: COLIC7.3 16.99,23.65 16.99,21.11 R52.1
N$85
  Bottom 1.27: COLIC7.4 19.53,23.65 19.53,22.07 22.54,19.05 R53.1
N$86
  Bottom 1.27: COLIC7.5 22.07,23.65 22.07,22.54 23.18,21.43 23.5,21.43 23.65,21.27 26.67,21.27 R54.1
N$87
  Bottom 1.27: COLIC7.6 24.61,24.61 24.61,25.72 25.88,26.99 31.11,26.99 31.11,25.72 31.27,25.56 31.27,19.84 R55.1
N$88
  Top 1.27: COLIC7.7 26.67,22.22 26.83,22.22 28.1,20.95 29.21,20.95 29.53,21.27 29.69,21.27 29.84,21.43 31.75,21.43 34.13,19.05 R56.1
N$89
  Bottom 1.27: COLIC8.15 46.51,31.27 46.51,29.84 41.91,25.24 R57.1
N$90
  Bottom 1.27: COLIC8.1 44.93,23.65 44.93,19.84 R58.1
N$91
  Bottom 1.27: COLIC8.2 47.47,23.65 47.47,21.11 R59.1
N$92
  Bottom 1.27: COLIC8.3 50.01,23.65 50.01,22.07 53.02,19.05 R60.1
N$93
  Bottom 1.27: COLIC8.4 52.55,23.65 52.55,22.54 53.66,21.43 53.98,21.43 54.13,21.27 57.15,21.27 R61.1
N$94
  Bottom 1.27: COLIC8.5 55.09,24.61 55.09,25.72 56.36,26.99 70.96,26.99 70.96,18.26 69.37,16.67 60.96,16.67 R62.1
N$95
  Top 1.27: COLIC8.6 57.15,23.49 57.31,23.49 57.63,23.18 57.63,22.22 57.94,22.22 58.9,21.27 60.17,21.27 60.33,21.43 61.6,21.43 61.75,21.27 61.91,21.27 63.98,19.21 64.45,19.21 64.61,19.05 R63.1
N$96
  Bottom 1.27: COLIC8.7 60.17,23.65 60.17,22.54 61.28,21.43 61.6,21.43 61.75,21.27 63.98,21.27 64.14,21.43 68.58,21.43 R64.1
N$97
  Bottom 1.27: COLIC9.15 83.03,32.23 83.03,33.81 87.95,38.73 106.05,38.73 106.05,19.37 105.25,18.57 105.25,18.26 103.66,16.67 76.2,16.67 R65.1
N$98
  Bottom 1.27: R66.1 COLIC9.1
N$99
  Bottom 1.27: COLIC9.2 83.03,23.65 83.03,19.84 R67.1
N$100
  Bottom 1.27: COLIC9.3 85.57,23.65 85.57,21.11 R68.1
N$101
  Bottom 1.27: COLIC9.4 88.11,23.65 88.11,22.07 91.12,19.05 R69.1
N$102
  Bottom 1.27: COLIC9.5 90.65,23.65 90.65,22.54 91.76,21.43 92.08,21.43 92.23,21.27 93.98,21.27 93.98,20.32 R70.1
N$103
  Bottom 1.27: COLIC9.6 93.19,24.61 93.19,25.72 94.46,26.99 99.85,26.99 99.85,19.84 R71.1
N$104  (via drill 1.27)
  Top 1.27: v97.31,20.95 97.79,20.95 98.11,21.27 98.27,21.27 98.42,21.43 100.33,21.43 102.71,19.05 R72.1
  Bottom 1.27: COLIC9.7 95.73,23.65 95.73,22.54 v97.31,20.95
N$105
  Bottom 1.27: COLIC10.15 118.9,31.27 118.9,30.16 111.76,23.02 R73.1
N$106
  Bottom 1.27: COLIC10.1 115.57,22.86 R74.1
N$107
  Bottom 1.27: R75.1 COLIC10.2
N$108
  Bottom 1.27: COLIC10.3 122.4,23.65 122.4,19.84 R76.1
N$109
  Bottom 1.27: COLIC10.4 124.94,23.65 124.94,21.11 R77.1
N$110
  Bottom 1.27: COLIC10.5 127.48,23.65 127.48,22.07 130.49,19.05 R78.1
N$111
  Bottom 1.27: COLIC10.6 130.02,23.65 130.02,22.54 131.13,21.43 131.45,21.43 131.6,21.27 134.62,21.27 R79.1
N$112
  Bottom 1.27: COLIC10.7 132.56,24.61 132.56,25.72 133.83,26.99 138.43,26.99 R80.1
N$113
  Bottom 1.27: COLIC11.15 155.73,31.27 155.73,30.16 147.32,21.75 R81.1
N$114
  Bottom 1.27: COLIC11.1 151.13,21.59 R82.1
N$115
  Bottom 1.27: COLIC11.2 155.73,23.65 155.73,19.84 R83.1
N$116
  Bottom 1.27: R84.1 COLIC11.3
N$117
  Bottom 1.27: COLIC11.4 161.77,23.65 161.77,19.84 R85.1
N$118
  Bottom 1.27: COLIC11.5 164.31,23.65 164.31,21.11 R86.1
N$119
  Bottom 1.27: COLIC11.6 166.85,23.65 166.85,22.38 R87.1
N$120  (via drill 1.27)
  Top 1.27: COLIC11.7 168.91,26.19 169.07,26.19 170.18,27.3 172.56,27.3 v174.15,25.72
  Bottom 1.27: v174.15,25.72 173.99,25.56 R88.1
N$121
  Bottom 1.27: COLIC12.15 188.75,31.27 188.75,30.16 182.88,24.29 R89.1
N$122
  Bottom 1.27: R90.1 COLIC12.1
N$123
  Bottom 1.27: COLIC12.2 189.71,23.65 189.71,19.84 R91.1
N$124
  Bottom 1.27: COLIC12.3 192.25,23.65 192.25,21.11 R92.1
N$125
  Bottom 1.27: COLIC12.4 194.79,23.65 194.79,22.07 197.8,19.05 R93.1
N$126
  Bottom 1.27: COLIC12.5 197.33,23.65 197.33,22.54 198.44,21.43 198.76,21.43 198.91,21.27 201.93,21.27 R94.1
N$127
  Bottom 1.27: COLIC12.6 199.87,24.61 199.87,25.72 201.14,26.99 206.53,26.99 206.53,19.84 R95.1
N$128
  Top 1.27: COLIC12.7 201.93,26.19 202.09,26.19 203.2,27.3 205.58,27.3 209.39,23.49 209.39,19.05 R96.1
N$129
  Bottom 1.27: JP1.1 R1.2
N$130
  Bottom 1.27: R2.2 13.97,44.45 JP1.2
N$131
  Bottom 1.27: R3.2 16.51,45.72 JP1.3
N$132
  Bottom 1.27: R4.2 19.05,46.99 JP1.4
N$133
  Bottom 1.27: JP1.5 R5.2
N$134
  Bottom 1.27: R6.2 24.13,46.99 JP1.6
N$135
  Bottom 1.27: R7.2 26.67,45.72 JP1.7
N$136
  Bottom 1.27: R8.2 29.21,44.45 JP1.8
N$137
  Bottom 1.27: R9.2 48.26,44.45 JP2.1
N$138
  Bottom 1.27: R10.2 50.8,45.72 JP2.2
N$139
  Bottom 1.27: R11.2 53.34,46.99 JP2.3
N$140
  Bottom 1.27: JP2.4 R12.2
N$141
  Bottom 1.27: R13.2 58.42,46.99 JP2.5
N$142
  Bottom 1.27: R14.2 60.96,45.72 JP2.6
N$143
  Bottom 1.27: R15.2 63.5,44.45 JP2.7
N$144
  Bottom 1.27: JP2.8 R16.2
N$145
  Bottom 1.27: R17.2 83.82,44.45 JP3.1
N$146
  Bottom 1.27: R18.2 86.36,45.72 JP3.2
N$147
  Bottom 1.27: R19.2 88.9,46.99 JP3.3
N$148
  Bottom 1.27: JP3.4 R20.2
N$149
  Bottom 1.27: R21.2 93.98,46.99 JP3.5
N$150
  Bottom 1.27: R22.2 96.52,45.72 JP3.6
N$151
  Bottom 1.27: R23.2 99.06,44.45 JP3.7
N$152
  Bottom 1.27: JP3.8 R24.2
N$153
  Bottom 1.27: JP4.1 R25.2
N$154
  Bottom 1.27: R26.2 124.46,44.45 JP4.2
N$155
  Bottom 1.27: R27.2 127,45.72 JP4.3
N$156
  Bottom 1.27: R28.2 129.54,46.99 JP4.4
N$157
  Bottom 1.27: JP4.5 R29.2
N$158
  Bottom 1.27: R30.2 134.62,46.99 JP4.6
N$159
  Bottom 1.27: R31.2 137.16,45.72 JP4.7
N$160
  Bottom 1.27: R32.2 139.7,44.45 JP4.8
N$161
  Bottom 1.27: R33.2 156.21,44.45 JP5.1
N$162
  Bottom 1.27: R34.2 158.75,45.72 JP5.2
N$163
  Bottom 1.27: R35.2 161.29,46.99 JP5.3
N$164
  Bottom 1.27: JP5.4 R36.2
N$165
  Bottom 1.27: R37.2 166.37,46.99 JP5.5
N$166
  Bottom 1.27: R38.2 168.91,45.72 JP5.6
N$167
  Bottom 1.27: R39.2 171.45,44.45 JP5.7
N$168
  Bottom 1.27: JP5.8 R40.2
N$169
  Bottom 1.27: R65.2 80.01,7.62 JP6.1
N$170
  Bottom 1.27: R66.2 82.55,8.89 JP6.2
N$171
  Bottom 1.27: R67.2 85.09,10.16 JP6.3
N$172
  Bottom 1.27: JP6.4 R68.2
N$173
  Bottom 1.27: R69.2 90.17,10.16 JP6.5
N$174
  Bottom 1.27: R70.2 92.71,8.89 JP6.6
N$175
  Bottom 1.27: R71.2 95.25,7.62 JP6.7
N$176
  Bottom 1.27: JP6.8 R72.2
N$177
  Bottom 1.27: JP7.1 R73.2
N$178
  Bottom 1.27: R74.2 119.38,7.62 JP7.2
N$179
  Bottom 1.27: R75.2 121.92,8.89 JP7.3
N$180
  Bottom 1.27: R76.2 124.46,10.16 JP7.4
N$181
  Bottom 1.27: JP7.5 R77.2
N$182
  Bottom 1.27: R78.2 129.54,10.16 JP7.6
N$183
  Bottom 1.27: R79.2 132.08,8.89 JP7.7
N$184
  Bottom 1.27: R80.2 134.62,7.62 JP7.8
N$185
  Bottom 1.27: R41.2 193.04,44.45 JP8.1
N$186
  Bottom 1.27: R42.2 195.58,45.72 JP8.2
N$187
  Bottom 1.27: R43.2 198.12,46.99 JP8.3
N$188
  Bottom 1.27: R44.2 200.66,48.26 JP8.4
N$189
  Bottom 1.27: JP8.5 R45.2
N$190
  Bottom 1.27: R46.2 205.74,48.26 JP8.6
N$191
  Bottom 1.27: R47.2 208.28,46.99 JP8.7
N$192
  Bottom 1.27: R48.2 210.82,45.72 JP8.8
N$193
  Bottom 1.27: R49.2 12.7,6.35 JP9.1
N$194
  Bottom 1.27: R50.2 15.24,7.62 JP9.2
N$195
  Bottom 1.27: R51.2 17.78,8.89 JP9.3
N$196
  Bottom 1.27: R52.2 20.32,10.16 JP9.4
N$197
  Bottom 1.27: JP9.5 R53.2
N$198
  Bottom 1.27: R54.2 25.4,10.16 JP9.6
N$199
  Bottom 1.27: R55.2 27.94,8.89 JP9.7
N$200
  Bottom 1.27: R56.2 30.48,7.62 JP9.8
N$201
  Bottom 1.27: JP10.1 R57.2
N$202
  Bottom 1.27: R58.2 49.53,7.62 JP10.2
N$203
  Bottom 1.27: R59.2 52.07,8.89 JP10.3
N$204
  Bottom 1.27: R60.2 54.61,10.16 JP10.4
N$205
  Bottom 1.27: JP10.5 R61.2
N$206
  Bottom 1.27: R62.2 59.69,10.16 JP10.6
N$207
  Bottom 1.27: R63.2 62.23,8.89 JP10.7
N$208
  Bottom 1.27: R64.2 64.77,7.62 JP10.8
N$209
  Bottom 1.27: JP11.1 R81.2
N$210
  Bottom 1.27: R82.2 154.94,7.62 JP11.2
N$211
  Bottom 1.27: R83.2 157.48,8.89 JP11.3
N$212
  Bottom 1.27: R84.2 160.02,10.16 JP11.4
N$213
  Bottom 1.27: JP11.5 R85.2
N$214
  Bottom 1.27: R86.2 165.1,10.16 JP11.6
N$215
  Bottom 1.27: R87.2 167.64,8.89 JP11.7
N$216
  Bottom 1.27: R88.2 170.18,7.62 JP11.8
N$217
  Bottom 1.27: R89.2 186.69,7.62 JP12.1
N$218
  Bottom 1.27: R90.2 189.23,8.89 JP12.2
N$219
  Bottom 1.27: R91.2 191.77,10.16 JP12.3
N$220
  Bottom 1.27: JP12.4 R92.2
N$221
  Bottom 1.27: R93.2 196.85,10.16 JP12.5
N$222
  Bottom 1.27: R94.2 199.39,8.89 JP12.6
N$223
  Bottom 1.27: R95.2 201.93,7.62 JP12.7
N$224
  Bottom 1.27: JP12.8 R96.2
N$225  (via drill 1.27)
  Top 1.27: v112.39,46.2 v117.16,41.43 | v111.28,52.86 111.12,52.7 106.84,52.7 v106.52,53.02 | v80.17,53.02 79.85,52.7 78.58,52.7 v72.87,58.42 | v51.12,80.49 48.42,77.79 v25.56,77.79 | v65.41,92.74 65.98,93.31 71.79,93.31 v72.55,92.55
  Bottom 1.27: COLIC10.14 121.44,32.23 121.44,37.15 v117.16,41.43 | v112.39,46.2 111.28,47.31 v111.28,52.86 | v80.17,53.02 v106.52,53.02 | v72.87,58.42 70.48,60.8 70.48,72.87 62.87,80.49 v51.12,80.49 | v25.56,77.79 21.91,81.44 21.91,83.34 30.8,92.23 64.9,92.23 v65.41,92.74 | v72.55,92.55 81.6,101.6 96.52,101.6 IC1.61
N$226  (via drill 1.27)
  Top 1.27: v154.46,34.77 154.15,35.08 152.08,35.08 v149.54,32.54 | v187.33,133.19 186.75,133.76 136.08,133.76 v135.45,133.13 | v105.89,119.7 v105.89,124.46
  Bottom 1.27: COLIC11.14 158.27,32.23 158.27,33.34 156.84,34.77 v154.46,34.77 | v149.54,32.54 144.94,27.94 144.94,18.26 146.53,16.67 218.28,16.67 218.28,123.03 208.12,133.19 v187.33,133.19 | v135.45,133.13 131.54,129.22 105.89,129.22 v105.89,124.46 | v105.89,119.7 101.44,115.25 101.44,100.81 99.85,99.22 99.22,99.22 IC1.60
N$227  (via drill 1.27)
  Top 1.27: COLIC12.14 191.77,33.81 191.93,33.81 193.52,35.4 205.74,35.4 214.31,26.83 v214.31,13.97 | v72.23,3.49 66.67,9.05 44.13,9.05 40.96,5.87 v40.8,5.87 | v3.33,16.83 4.45,17.94 4.45,37.62 34.77,37.62 42.23,45.09 42.23,47.47 36.2,53.5 36.2,57.78 35.72,57.78 35.56,57.94 34.13,57.94 33.81,58.26 33.66,58.26 32.86,59.05 28.26,59.05 27.78,58.58 10.64,58.58 10,59.21 9.53,59.21 8.41,60.33 8.41,72.71 v9.37,72.71 | v47.62,121.6 v20.64,94.61 | v67.79,101.44 69.85,99.38 73.5,99.38 v78.1,94.77
  Bottom 1.27: v214.31,13.97 214,13.65 214,9.52 206.38,1.91 72.23,1.91 v72.23,3.49 | v40.8,5.87 36.83,1.91 3.33,1.91 v3.33,16.83 | v9.37,72.71 12.54,75.88 12.54,86.52 v20.64,94.61 | v67.79,101.44 v47.62,121.6 | v78.1,94.77 82.39,99.06 96.52,99.06 IC1.59
N$236
  Bottom 1.27: LAYERSR2.1 143.03,93.19 143.03,98.9 140.97,100.97 Q10.1
N$237  (via drill 1.27)
  Top 1.27: v141.76,67.47 141.92,67.31 141.92,66.2 119.06,66.2 112.43,72.84 105.47,72.84 103.22,75.09 v83.82,75.09
  Bottom 1.27: LAYERSR2.14 138.75,84.77 138.75,78.26 141.76,75.25 v141.76,67.47 | v83.82,75.09 78.58,75.09 78.42,74.93 75.88,74.93 75.88,75.56 73.98,77.47 73.98,83.66 73.82,83.82 IC1.29
N$238  (via drill 1.27)
  Top 1.27: v59.69,94.61 64.14,90.17 73.06,90.17 v73.44,89.79
  Bottom 1.27: COLIC1.14 16.16,70.2 16.16,80.99 14.61,82.55 14.61,85.25 23.97,94.61 v59.69,94.61 | v73.44,89.79 76.2,87.03 76.2,83.98 IC1.28
N$239  (via drill 1.27)
  Top 1.27: v61.28,75.72 62.87,77.31 v77.47,77.31
  Bottom 1.27: COLIC2.14 53.82,70.33 53.82,73.18 56.36,75.72 v61.28,75.72 | v77.47,77.31 78.74,78.58 78.74,83.82 IC1.27
N$240
  Bottom 1.27: COLIC3.14 89.69,70.33 89.69,72.55 81.44,80.8 81.44,83.82 IC1.26
N$241  (via drill 1.27)
  Top 1.27: v124.3,73.66 122.94,75.03 109.03,75.03 107.82,76.23 v105.41,76.23
  Bottom 1.27: COLIC4.14 126.52,70.33 126.52,71.44 v124.3,73.66 | v105.41,76.23 89.03,76.23 83.98,81.28 83.98,83.82 IC1.25
N$242  (via drill 1.27)
  Top 1.27: v170.66,39.53 170.5,39.53 v166.53,35.56 166.05,35.88 163.2,38.73 v134.62,38.73 | v168.12,75.72 168.75,76.36 v175.1,76.36 | v189.07,35.24 188.75,35.56 183.04,35.56 v181.77,36.83 | v197.17,65.72 196.69,66.2 193.04,66.2 v190.5,68.74 | v145.57,87.95 150.97,93.34 v152.72,93.34 | v103.66,33.02 108.9,27.78 v119.86,27.78 | v23.97,35.24 24.13,35.4 v51.44,35.4 | v28.26,75.09 28.57,75.41 v34.61,75.41 | v56.83,72.87 54.29,75.41 v46.04,75.41 | v82.39,64.13 82.07,64.45 75.25,64.45 | 75.25,64.45 68.1,64.45 66.36,66.2 60.96,66.2 58.74,68.42 58.74,69.85 COLIC2.12 | v70.48,40.16 73.34,43.02 v75.25,43.02 75.72,42.7 78.58,39.85 83.98,39.85 90.01,33.81 90.17,33.81 COLIC9.12 | v75.25,63.98 75.25,64.45
  Bottom 1.27: COLIC4.12 132.08,82.23 133.35,83.5 LAYERSR2.12 133.67,85.57 133.83,85.72 133.83,86.68 135.1,87.95 v145.57,87.95 | COLIC11.12 164.31,32.23 164.31,33.34 v166.53,35.56 | 181.45,39.53 v170.66,39.53 | 181.45,68.74 181.45,70.01 176.05,75.41 176.05,76.36 | 181.45,68.74 181.45,39.53 | 176.05,76.36 176.05,82.23 177.8,83.98 LAYERSR1.12 | COLIC5.12 168.12,70.33 v168.12,75.72 167.8,76.2 167.8,78.26 v152.72,93.34 | v175.1,76.36 176.05,76.36 | COLIC12.12 196.37,32.23 196.37,33.34 194.47,35.24 v189.07,35.24 | v181.77,36.83 181.77,39.05 181.45,39.53 | COLIC6.12 203.99,69.37 203.99,68.26 201.45,65.72 v197.17,65.72 | 181.45,68.74 v190.5,68.74 | COLIC9.12 90.65,32.23 90.65,33.34 91.92,34.61 102.08,34.61 v103.66,33.02 | v119.86,27.78 127,27.78 COLIC10.12 127.32,32.23 127.32,34.61 130.49,34.61 v134.62,38.73 | COLIC7.12 22.07,32.23 22.07,33.34 v23.97,35.24 | 54.61,35.4 v51.44,35.4 | COLIC8.12 54.61,35.4 | COLIC1.12 22.07,70.33 22.07,71.91 25.24,75.09 v28.26,75.09 | v34.61,75.41 40.16,80.96 44.45,80.96 | 44.45,80.96 44.45,83.82 IC1.39 | COLIC2.12 57.94,70.33 57.94,71.75 v56.83,72.87 | v46.04,75.41 44.77,76.68 44.77,80.49 44.45,80.96 | COLIC3.12 94.77,69.37 94.77,64.96 82.39,64.96 v82.39,64.13 | v70.48,40.16 57.63,40.16 55.09,37.62 55.09,36.04 54.93,35.88 54.61,35.4 | v75.25,63.98 v75.25,43.02
N$243  (via drill 1.27)
  Top 1.27: v156.21,77.31 154.46,75.56 136.84,75.56 135.41,74.14 v129.7,74.14 | v124.3,81.6 119.38,86.52 119.38,90.17 v119.15,90.4 | v112.87,94.61 119.38,94.61 v119.32,94.56
  Bottom 1.27: COLIC5.14 162.08,70.33 162.08,71.44 v156.21,77.31 | v129.7,74.14 126.36,77.47 124.3,77.47 v124.3,81.6 | v112.87,94.61 103.5,94.61 103.5,82.07 100.01,78.58 89.69,78.58 86.52,81.76 86.52,83.82 IC1.24 | v119.32,94.56 119.32,90.57 v119.15,90.4
N$244  (via drill 1.27)
  Top 1.27: LAYERSR1.11 174.94,85.09 174.94,83.66 v170.34,79.06 169.86,79.38 167.48,81.76 144.94,81.76 144.62,81.44 142.56,81.44 142.08,81.91 140.18,81.91 135.1,76.84 134.94,76.84 v134.46,76.52 131.6,79.38 127,79.38 v126.68,79.85 125.09,78.26 124.62,78.74 v121.95,78.74 | 198.2,79.77 195.26,82.71 v193.99,82.71 | 198.2,79.77 v198.76,79.22 | v131.76,28.26 132.24,27.78 140.49,27.78 | v156.69,27.78 140.49,27.78 | v189.55,27.62 189.07,28.1 v183.36,28.1 | v36.99,73.03 v33.66,69.69 | v24.13,28.57 24.92,27.78 v33.5,27.78 | v73.34,25.08 75.09,26.83 75.09,28.1 | v75.09,29.69 75.09,28.1 | 92.71,28.1 COLIC9.11 | 75.09,28.1 92.71,28.1 | v72.87,50.16 74.3,48.74 74.3,45.4 v72.87,45.4 | v108.27,18.26 98.74,27.78 93.19,27.78 92.71,28.1 | v140.49,28.26 140.49,27.78 | 198.2,79.77 184.78,66.36 184.78,48.1 v187.64,45.24 | v116.97,78.74 114.29,78.74 113.84,78.3 113,78.3 v112.24,77.53 | COLIC3.11 98.27,69.37 98.27,68.34 101.66,64.95 112.22,64.95 v112.24,64.96
  Bottom 1.27: COLIC5.11 170.5,70.17 170.5,78.9 v170.34,79.06 | COLIC6.11 206.53,70.33 206.53,71.44 v198.76,79.22 | v193.99,82.71 188.75,87.95 175.26,87.95 LAYERSR1.11 | v112.24,77.53 v112.24,64.96 | v126.68,79.85 130.81,83.98 LAYERSR2.11 | COLIC4.11 134.46,70.01 v134.46,76.52 | COLIC10.11 130.02,31.27 130.02,30 v131.76,28.26 | 166.37,27.78 v156.69,27.78 | COLIC11.11 166.37,27.78 | v189.55,27.62 196.37,27.62 198.91,30.16 198.91,31.27 COLIC12.11 199.07,32.23 199.07,33.81 v187.64,45.24 | v183.36,28.1 166.85,28.1 166.37,27.78 | COLIC1.11 24.61,70.33 24.61,71.44 25.88,72.71 30.96,72.71 30.96,72.39 v33.66,69.69 | 42.07,73.03 48.42,73.03 48.42,78.1 | 42.07,73.03 v36.99,73.03 | 48.42,78.1 48.42,83.82 IC1.38 | COLIC2.11 60.96,72.07 63.66,74.77 63.66,76.68 62.23,78.1 48.42,78.1 | v24.13,28.57 COLIC7.11 | v33.5,27.78 39.53,21.75 39.53,18.26 43.18,14.6 73.18,14.6 73.18,24.92 v73.34,25.08 | v75.09,29.69 74.77,30 74.77,35.56 73.66,36.67 72.87,36.67 | 72.87,36.67 57.15,36.67 COLIC8.11 | 42.07,73.03 42.07,55.09 44.13,53.02 72.87,53.02 v72.87,50.16 | 72.87,36.67 v72.87,45.4 | v140.49,28.26 140.81,27.94 140.81,18.26 139.22,16.67 108.27,16.67 v108.27,18.26 | v116.97,78.74 v121.95,78.74
N$245  (via drill 1.27)
  Top 1.27: v191.14,94.46 188.44,97.16 162.4,97.16 160.66,98.9 160.66,104.77 118.4,104.77 v110.74,97.12
  Bottom 1.27: COLIC6.14 198.91,70.33 198.91,75.72 196.37,78.26 196.37,89.22 v191.14,94.46 | v110.74,97.12 101.44,97.12 101.44,83.03 99.06,80.64 90.65,80.64 90.65,81.44 89.06,83.03 89.06,83.82 IC1.23
Q3
  Bottom 1.27: LAYERSR1.1 188.75,93.5 188.75,95.41 193.2,99.85 193.2,102.39 203.2,112.39 Q2.1
VCC  (via drill 1.27)
  Top 1.27: v151.45,69.85 153.03,69.85 | 153.03,69.85 COLIC5.16 | v179.39,75.41 177.48,73.5 169.23,73.5 169.07,73.34 167.16,73.34 167.01,73.5 156.21,73.5 153.03,70.33 153.03,69.85 | COLIC1.16 11.43,66.2 11.59,66.04 v15.24,66.04 | COLIC2.16 40.8,69.85 37.15,66.2 34.93,66.2 | v26.04,40 26.19,39.85 32.7,39.85 v33.81,40.96 | 34.93,66.2 34.93,60.17 v37.31,60.17 | v77.63,68.9 78.58,69.85 COLIC3.16 | v111.44,41.12 v106.68,41.12 | v75.88,37.78 v44.77,37.78 | v145.26,36.2 145.1,36.35 133.67,36.35 v131.29,38.73 | v25.85,66.22 25.87,67.02 31.71,67.02 v32.22,66.51 | v35.55,67.81 35.55,66.82 34.93,66.2
  Bottom 1.27: COLIC12.16 186.69,42.86 185.26,44.29 185.26,60.17 194.31,69.22 COLIC6.16 193.99,70.33 193.99,79.06 LAYERSR1.16 188.12,84.14 v179.39,75.41 | LAYERSR2.16 143.51,76.68 149.7,70.48 149.7,69.85 | 149.7,36.2 149.7,35.72 COLIC11.16 | 149.7,36.2 149.7,69.85 | 149.7,69.85 v151.45,69.85 | COLIC7.16 11.43,32.86 18.57,40 v26.04,40 | 40.88,33.89 43.02,31.75 COLIC8.16 | 40.88,33.89 37.07,37.7 | 37.07,37.7 v33.81,40.96 | v37.31,60.17 37.47,60.01 37.47,38.1 37.07,37.7 | COLIC9.16 77.63,34.13 77.63,37.78 | v77.63,68.9 77.63,40.8 | 77.63,40.8 77.63,37.78 | COLIC10.16 114.78,33.81 114.78,41.12 | 114.78,46.67 114.78,47.15 114.14,47.78 114.14,57.31 117.47,60.64 117.47,65.41 COLIC4.16 | 114.78,46.67 114.78,41.12 | 77.63,40.8 106.68,40.8 v106.68,41.12 | 114.78,41.12 v111.44,41.12 | v44.77,37.78 40.88,33.89 | 77.63,37.78 v75.88,37.78 | v145.26,36.2 149.7,36.2 | v131.29,38.73 122.87,38.73 122.87,38.89 119.54,42.23 119.54,42.39 115.25,46.67 114.78,46.67 | v15.24,66.04 25.66,66.04 v25.85,66.22 | v32.22,66.51 33.05,67.34 34.63,67.34 35.1,67.81 v35.55,67.81
VIN  (via drill 1.27)
  Top 1.27: v70.17,87.79 69.06,87.79 69.06,81.44 68.9,81.44 v67.63,80.17 | v75.25,67.47 76.2,66.52 84.04,66.52 84.79,65.77 v97.52,65.77 | v20.17,79.86 20.17,81.61 21.16,82.6 21.16,87.2 v21.59,87.63 | v25.4,92.27 25.4,95.06 v31.75,101.41 | v46.36,116.21 v51.35,121.2
  Bottom 1.27: 55.96,124.54 70.17,110.33 v70.17,87.79 | 55.96,124.54 48.42,132.08 IC1.6 | v67.63,80.17 75.25,72.55 v75.25,67.47 | VIN-ARD.1 108.51,102.87 116.52,94.86 116.52,87.79 109.85,81.12 109.85,67.47 108.16,65.77 v97.52,65.77 | C1.1 19.18,78.87 v20.17,79.86 | v21.59,87.63 21.59,88.46 v25.4,92.27 | v31.75,101.41 46.36,116.02 v46.36,116.21 | v51.35,121.2 54.69,124.54 55.96,124.54
(copper drawn outside any net)
  shapes: Top area x2

## Text on the board
tPlace: LED SCULPTURE | ENVISAGE IIT MADRAS